# Altium schematic sheet Usb_SdCard.SchDoc
size A4
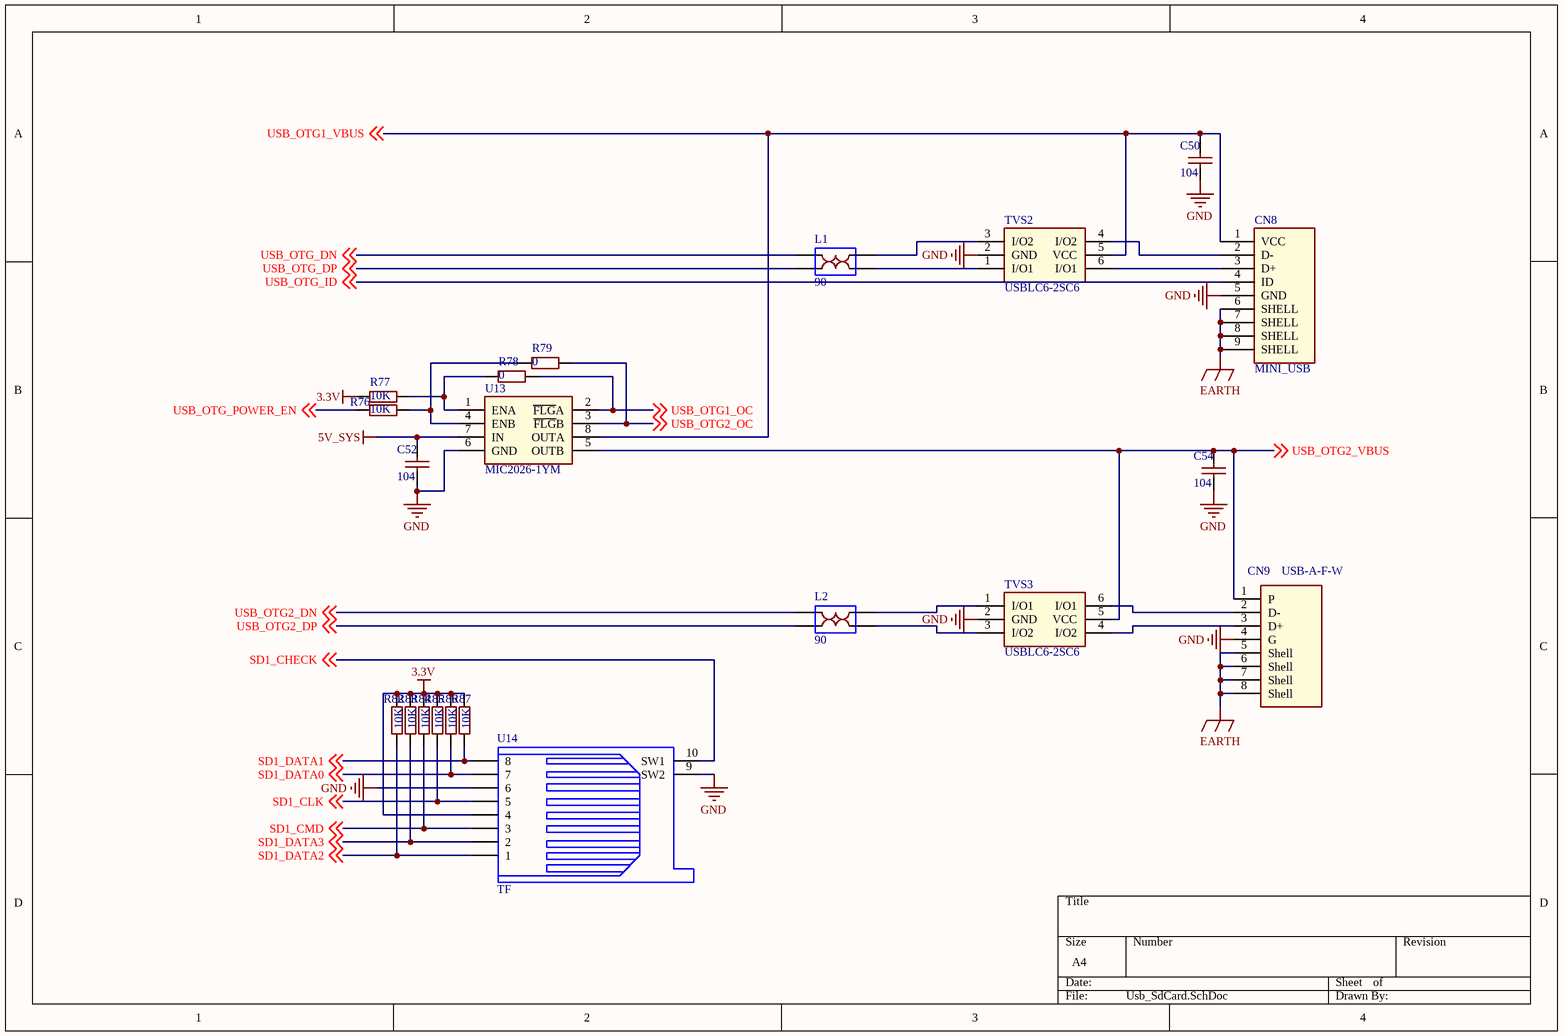
[diagram p0: Usb_SdCard.SchDoc]

## Parts
C50  104  [0805SMD_Cap]
C52  104  [0805SMD_Cap]
C54  104  [0805SMD_Cap]
CN8  MINI_USB  [MICRO_USB]
CN9  USB-A-F-W  [USB-C]
L1  90  [2012]
L2  90  [2012]
R76  10K  [0805_SMD_R]
R77  10K  [0805_SMD_R]
R78  0  [0805_SMD_R]
R79  0  [0805_SMD_R]
R82  10K  [0805_SMD_R]
R83  10K  [0805_SMD_R]
R84  10K  [0805_SMD_R]
R85  10K  [0805_SMD_R]
R86  10K  [0805_SMD_R]
R87  10K  [0805_SMD_R]
TVS2  USBLC6-2SC6  [SOT-23-6]
TVS3  USBLC6-2SC6  [SOT-23-6]
U13  MIC2026-1YM  [运放SO8]
U14  TF  [TF]

## Nets
3.3V: R77.2 R82.2 R83.2 R84.2 R85.2 R86.2 R87.2 U14.4
5V_SYS: C52.1 U13.7(IN)
EARTH: CN8.6(SHELL) CN8.7(SHELL) CN8.8(SHELL) CN8.9(SHELL) CN9.5(Shell) CN9.6(Shell) CN9.7(Shell) CN9.8(Shell)
GND: C50.2 C52.2 C54.2 CN8.5(GND) CN9.4(G) TVS2.2(GND) TVS3.2(GND) U13.6(GND) U14.6 U14.9(SW2)
SD1_CHECK: U14.10(SW1) ; off-sheet SD1_CHECK
SD1_CLK: R85.1 U14.5 ; off-sheet SD1_CLK
SD1_CMD: R84.1 U14.3 ; off-sheet SD1_CMD
SD1_DATA0: R86.1 U14.7 ; off-sheet SD1_DATA0
SD1_DATA1: R87.1 U14.8 ; off-sheet SD1_DATA1
SD1_DATA2: R82.1 U14.1 ; off-sheet SD1_DATA2
SD1_DATA3: R83.1 U14.2 ; off-sheet SD1_DATA3
USB_OTG1_OC: R78.1 U13.2(~{FLG}A) ; off-sheet USB_OTG1_OC
USB_OTG1_VBUS: C50.1 CN8.1(VCC) TVS2.5(VCC) U13.8(OUTA) ; off-sheet USB_OTG1_VBUS
USB_OTG2_DN: L2.1 ; off-sheet USB_OTG2_DN
USB_OTG2_DP: L2.2 ; off-sheet USB_OTG2_DP
USB_OTG2_OC: R79.1 U13.3(~{FLG}B) ; off-sheet USB_OTG2_OC
USB_OTG2_VBUS: C54.1 CN9.1(P) TVS3.5(VCC) U13.5(OUTB) ; off-sheet USB_OTG2_VBUS
USB_OTG_DN: L1.2 ; off-sheet USB_OTG_DN
USB_OTG_DP: L1.1 ; off-sheet USB_OTG_DP
USB_OTG_ID: CN8.4(ID) ; off-sheet USB_OTG_ID
USB_OTG_POWER_EN: R76.2 ; off-sheet USB_OTG_POWER_EN
NetCN8_2: CN8.2(D-) TVS2.4(I/O2)
NetCN8_3: CN8.3(D+) TVS2.6(I/O1)
NetCN9_2: CN9.2(D-) TVS3.6(I/O1)
NetCN9_3: CN9.3(D+) TVS3.4(I/O2)
NetL1_3: L1.3 TVS2.3(I/O2)
NetL1_4: L1.4 TVS2.1(I/O1)
NetL2_3: L2.3 TVS3.3(I/O2)
NetL2_4: L2.4 TVS3.1(I/O1)
NetR76_1: R76.1 R79.2 U13.4(ENB)
NetR77_1: R77.1 R78.2 U13.1(ENA)

## Library data of the parts
C50 C52 C54 = SMD_Cap: 贴片电容; 研究所: 贴装电容_0805_0.1uF; 松下: GR21BB1H104K; 松下: GR21BB1H224K; 松下: GR21BB1H103K; 研究所: 贴装电容_0805_0.22uF; 研究所: 贴装电容_0805_0.01uF; 松下: GR21BB1H473K; 研究所: 贴装电容_0805_0.047uF; 松下: GR21BB1H300K; 研究所: 贴装电容_0805_30pF; 松下: GR21BB1H105K; 研究所: 贴装电容_0805_1uF; 松下: GR21BB1H472K; 研究所: 贴装电容_0805_4700pF
L1 L2 = 共模电感
R76-R79 R82-R87 = SMD_0805: 贴片电阻; 松下: RS05K101FT; 松下: RS05000FT; 松下: RS05K3321FT; 松下: RS05K6811FT; 松下: RS05K102FT; 松下: RS05K2211FT; 松下: RS05K103FT; 松下: RS05K5111FT; 松下: RS05K5110FT; 松下: RS05K5112FT; 松下: RS05K8251FT; 松下: RS05K2212FT; 松下: RS05K104FT; 松下: RS05K5113FT; 松下: RS05K105FT; 松下: RS05L106FT; 研究所: 贴装电阻_0805_0_F1%; 研究所: 贴装电阻_0805_100_F1%; 研究所: 贴装电阻_0805_51.1K_F1%; 研究所: 贴装电阻_0805_1K_F1%; 研究所: 贴装电阻_0805_2.21K_F1%; 研究所: 贴装电阻_0805_3.32K_F1%; 研究所: 贴装电阻_0805_5.11K_F1%; 研究所: 贴装电阻_0805_511K_F1%; 研究所: 贴装电阻_0805_6.81K_F1%; 研究所: 贴装电阻_0805_511_F1%; 研究所: 贴装电阻_0805_8.25K_F1%; 研究所: 贴装电阻_0805_10K_F1%; 研究所: 贴装电阻_0805_22.1K_F1%; 研究所: 贴装电阻_0805_100K_F1%; 研究所: 贴装电阻_0805_1M_F1%; 研究所: 贴装电阻_0805_10M_F1%